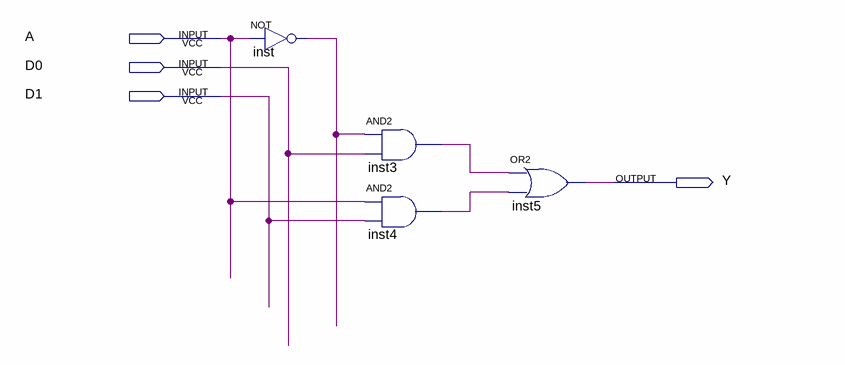
[diagram p0: schematic sheet]
// Quartus schematic Mux21.bdf as structural Verilog: 4 symbols, 4 pins
module Mux21 (
  input  A,
  input  D0,
  input  D1,
  output Y
);

  wire inst3_out, inst4_out, inst_out;

  not inst (inst_out, A);
  and inst3 (inst3_out, inst_out, D0);
  and inst4 (inst4_out, A, D1);
  or inst5 (Y, inst3_out, inst4_out);
endmodule
